# EAGLE design oscillator-v2 (EAGLE 8.7.1)
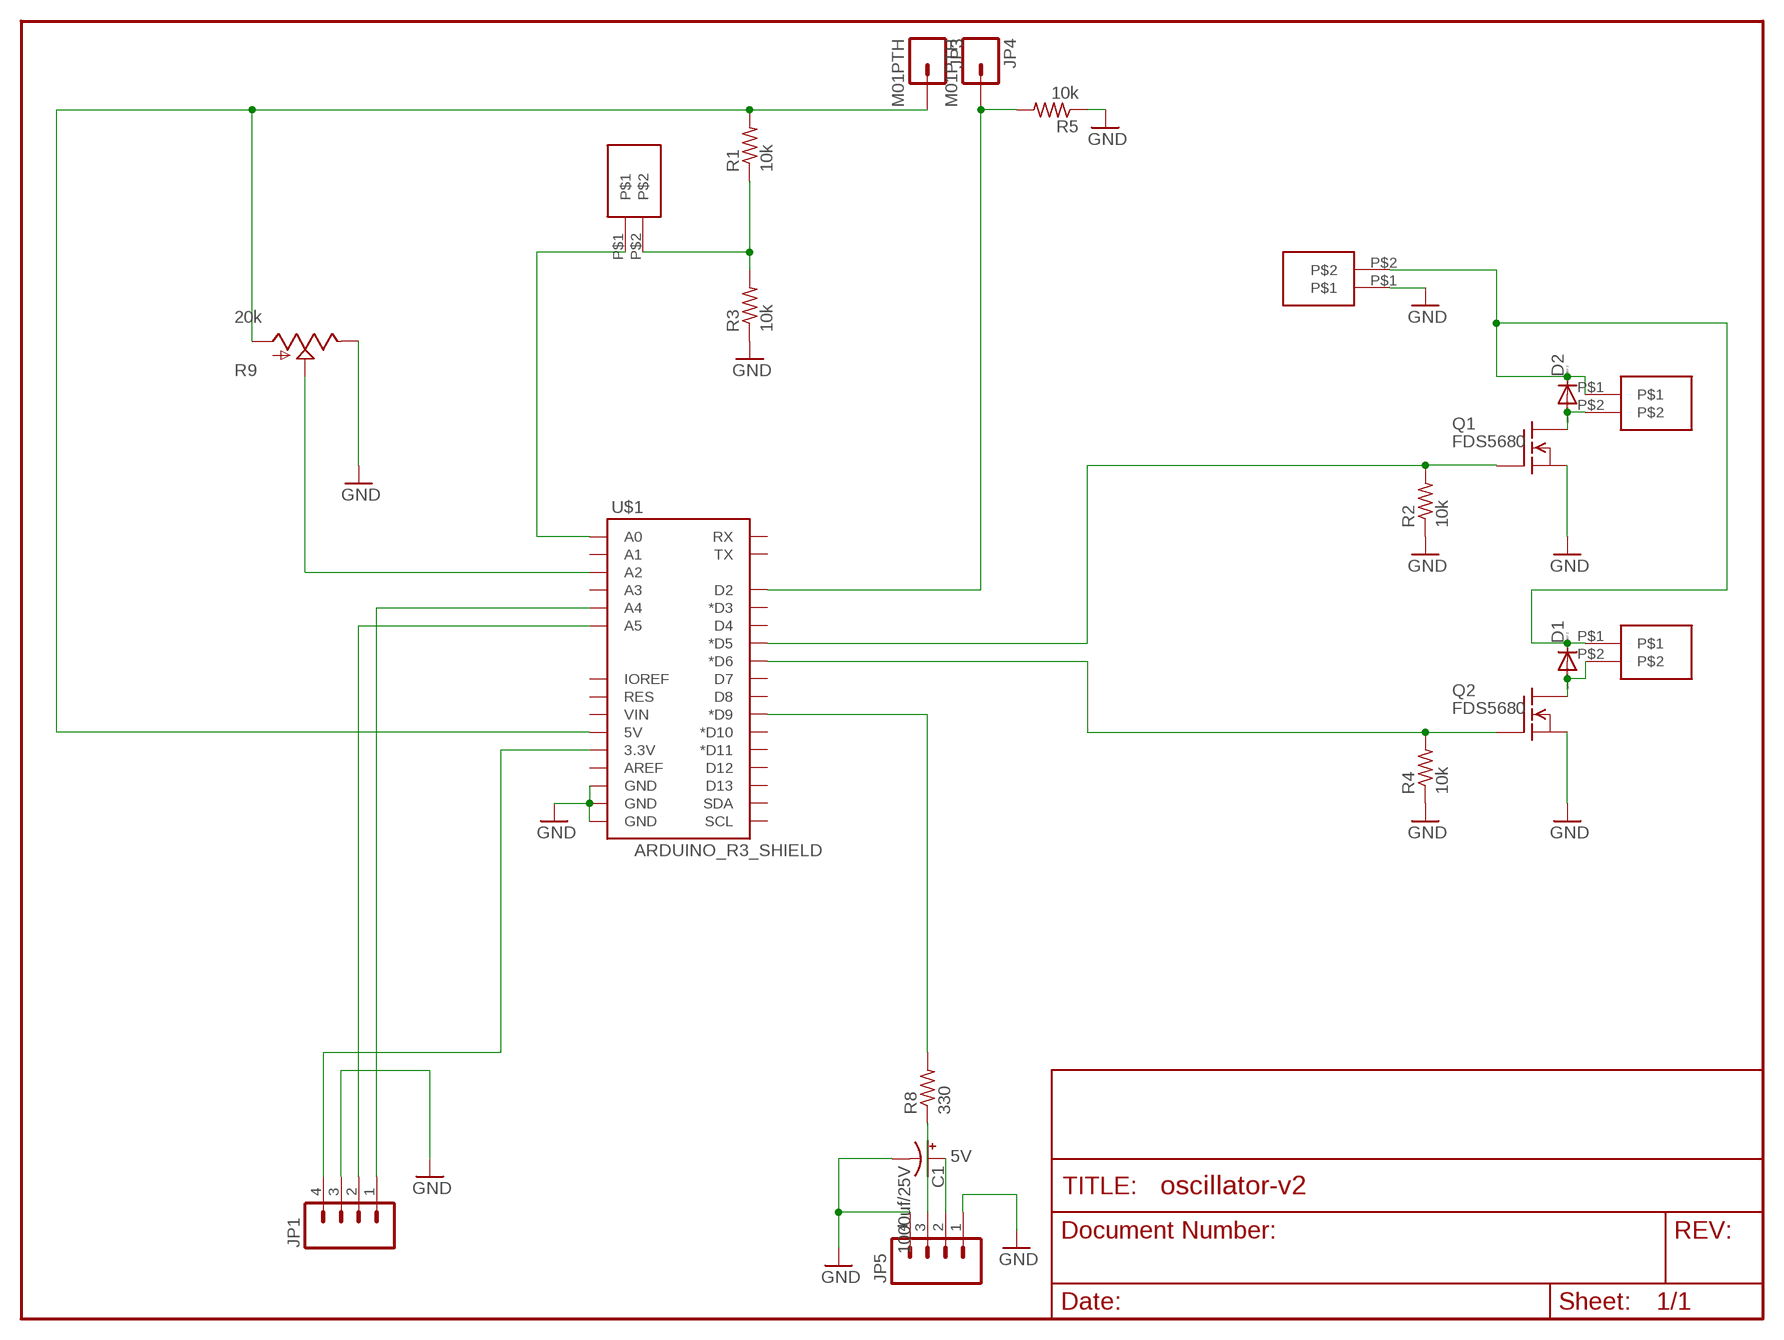
[diagram p0: schematic, sheet 1]

## Parts
C1  1000uf/25V  1000UF-25V(PTH)KIT  [CPOL-RADIAL-1000UF-25V-KIT]
D1  DIODE-DO-214AC  [DO-214AC]
D2  DIODE-DO-214AC  [DO-214AC]
JP1  M04PTH  [1X04]
JP3  M01PTH  [1X01]
JP4  M01PTH  [1X01]
JP5  M04PTH  [1X04]
Q1  FDS5680  [SO-8]
Q2  FDS5680  [SO-8]
R1  10k  R-US_R0603  [R0603]
R2  10k  R-US_R0603  [R0603]
R3  10k  R-US_R0603  [R0603]
R4  10k  R-US_R0603  [R0603]
R5  10k  R-US_R0603  [R0603]
R8  330  R-US_R0603  [R0603]
R9  20k  POTALPS-KIT  [ALPS_POT_KIT]
U$1  ARDUINO_R3_SHIELD  [UNO_R3_SHIELD]
U$6  SPRING-TERMINAL  [SPRING-TERMINAL]
X1  SPRING-TERMINAL  [SPRING-TERMINAL]
X2  SPRING-TERMINAL  [SPRING-TERMINAL]
X5  SPRING-TERMINAL  [SPRING-TERMINAL]

## Nets
5V: C1.+ JP3.1 JP5.2 R1.2 R9.P$3(A) U$1.5V
BUTTON: JP4.1 R5.2 U$1.D2
CL: JP1.2 U$1.A5
DA: JP1.1 U$1.A4
GND: C1.- JP1.3 JP5.1 JP5.4 Q1.1(S) Q1.2(S) Q1.3(S) Q2.1(S) Q2.2(S) Q2.3(S) R2.1 R3.1 R4.1 R5.1 R9.P$1(E) U$1.GND@0(GND) U$1.GND@1(GND) U$1.GND@2(GND) X1.P$1
N$1: Q1.4(G) R2.2 U$1.D5(*D5)
N$4: R8.2 U$1.D9(*D9)
N$5: R1.1 R3.2 X2.P$2
N$8: D2.A Q1.5(D) Q1.6(D) Q1.7(D) Q1.8(D) U$6.P$2
N$12: D1.A Q2.5(D) Q2.6(D) Q2.7(D) Q2.8(D) X5.P$2
N$14: Q2.4(G) R4.2 U$1.D6(*D6)
N$23: U$1.A0 X2.P$1
N$25: JP5.3 R8.1
N$28: R9.P$2(S) U$1.A2
VCC: JP1.4 U$1.3.3V
VIN: D1.C D2.C U$6.P$1 X1.P$2 X5.P$1
Unconnected: U$1.A1 U$1.A3 U$1.AREF U$1.D3(*D3) U$1.D4 U$1.D7 U$1.D8 U$1.D10(*D10) U$1.D11(*D11) U$1.D12 U$1.D13 U$1.IOREF U$1.RES U$1.RX U$1.SCL U$1.SDA U$1.TX U$1.VIN

## Library data of the parts
C1 = SparkFun-Capacitors:1000UF-25V(PTH): CAP-08070; PROD_ID: CAP-09538
D1 D2 = diode:DIODE-: DIODE
JP1 JP5 = SparkFun-Connectors:M04: Header 4 Standard 4-pin 0.1" header. Use with straight break away headers (SKU : PRT-00116), right angle break away headers (PRT-00553), swiss pins (PRT-00743), machine pins (PRT-00117), and female headers (PRT-00115). Molex polarized connector foot print use with SKU : PRT-08231 with associated crimp pins and housings. 1MM SMD Version SKU: PRT-10208
JP3 JP4 = SparkFun-Connectors:M01: Header 1 Standard 1-pin 0.1" header. Use with straight break away headers (SKU : PRT-00116), right angle break away headers (PRT-00553), swiss pins (PRT-00743), machine pins (PRT-00117), and female headers (PRT-00115).
Q1 Q2 = transistor-fet:FDS5680: 60V N-Channel PowerTrench TM MOSFET FAIRCHILD FDS5680.pdf
R1-R5 R8 = resistor:R-US_: RESISTOR, American symbol
R9 = SparkFun-Electromechanical:POT
U$1 = SparkFun-Boards:ARDUINO_R3_SHIELD: Shield form compatible with the Arduino Uno R3.
U$6 X1 X2 X5 = spietz-library:SPRING-TERMINAL

## Net classes
0 default: width 0.203 mm
1 vcc: width 0.254 mm

## Board
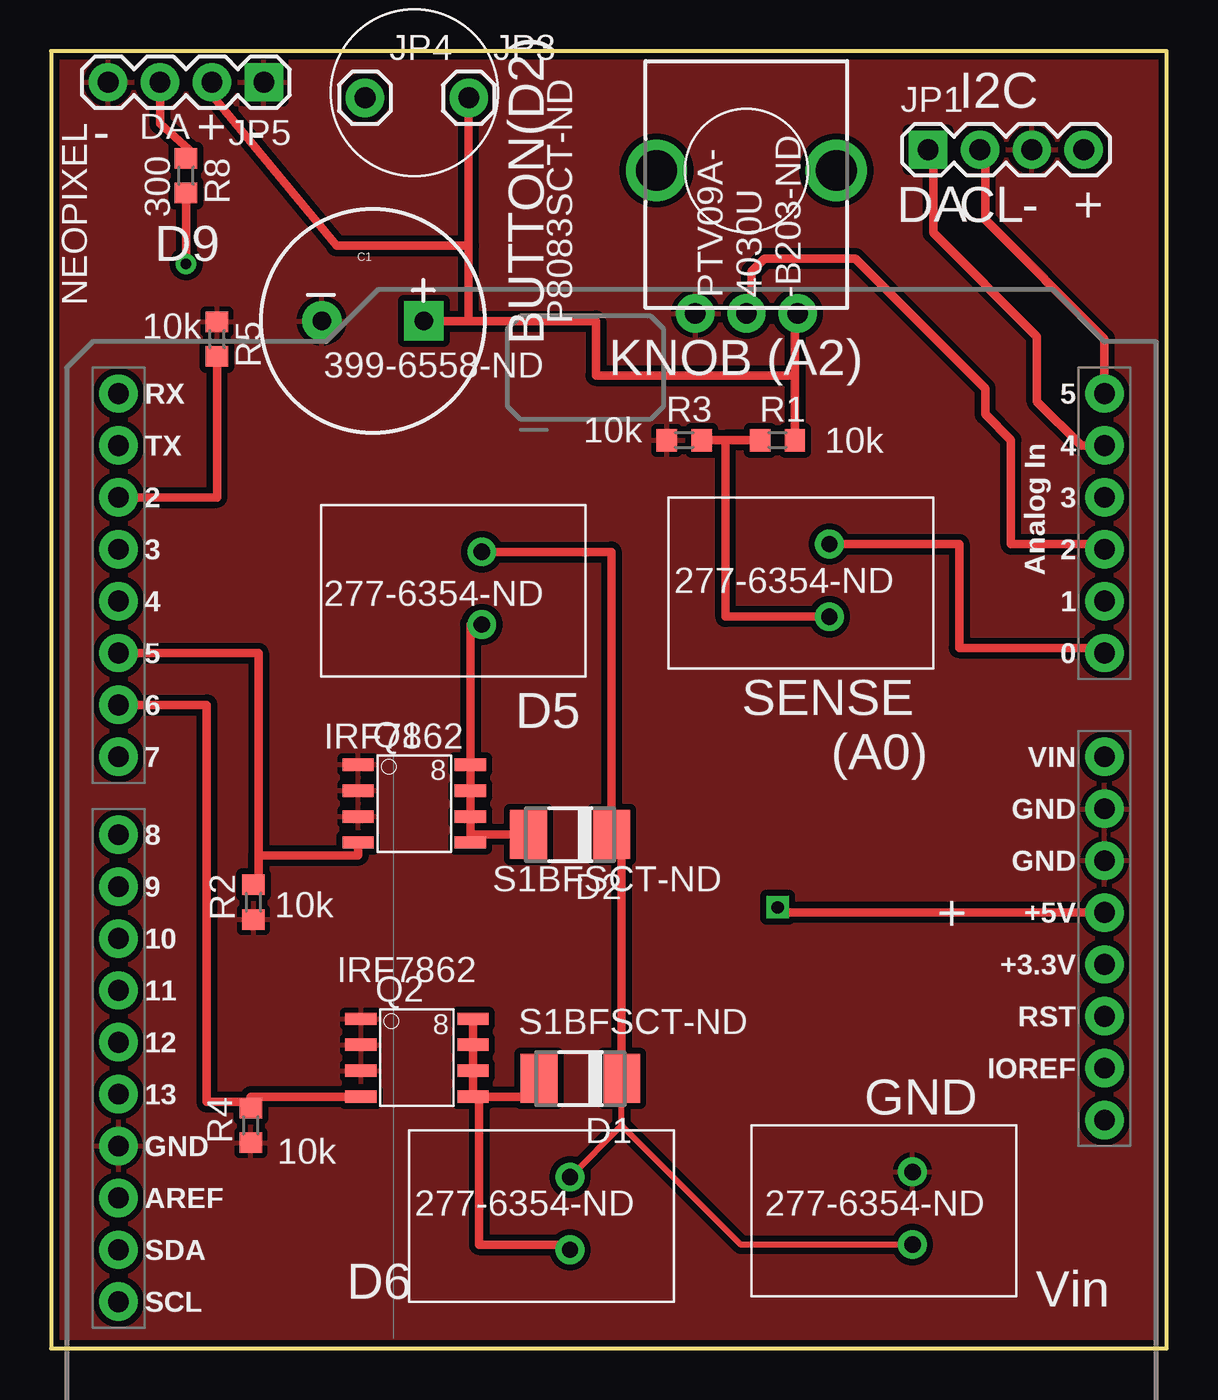
[diagram p1: board, top side]
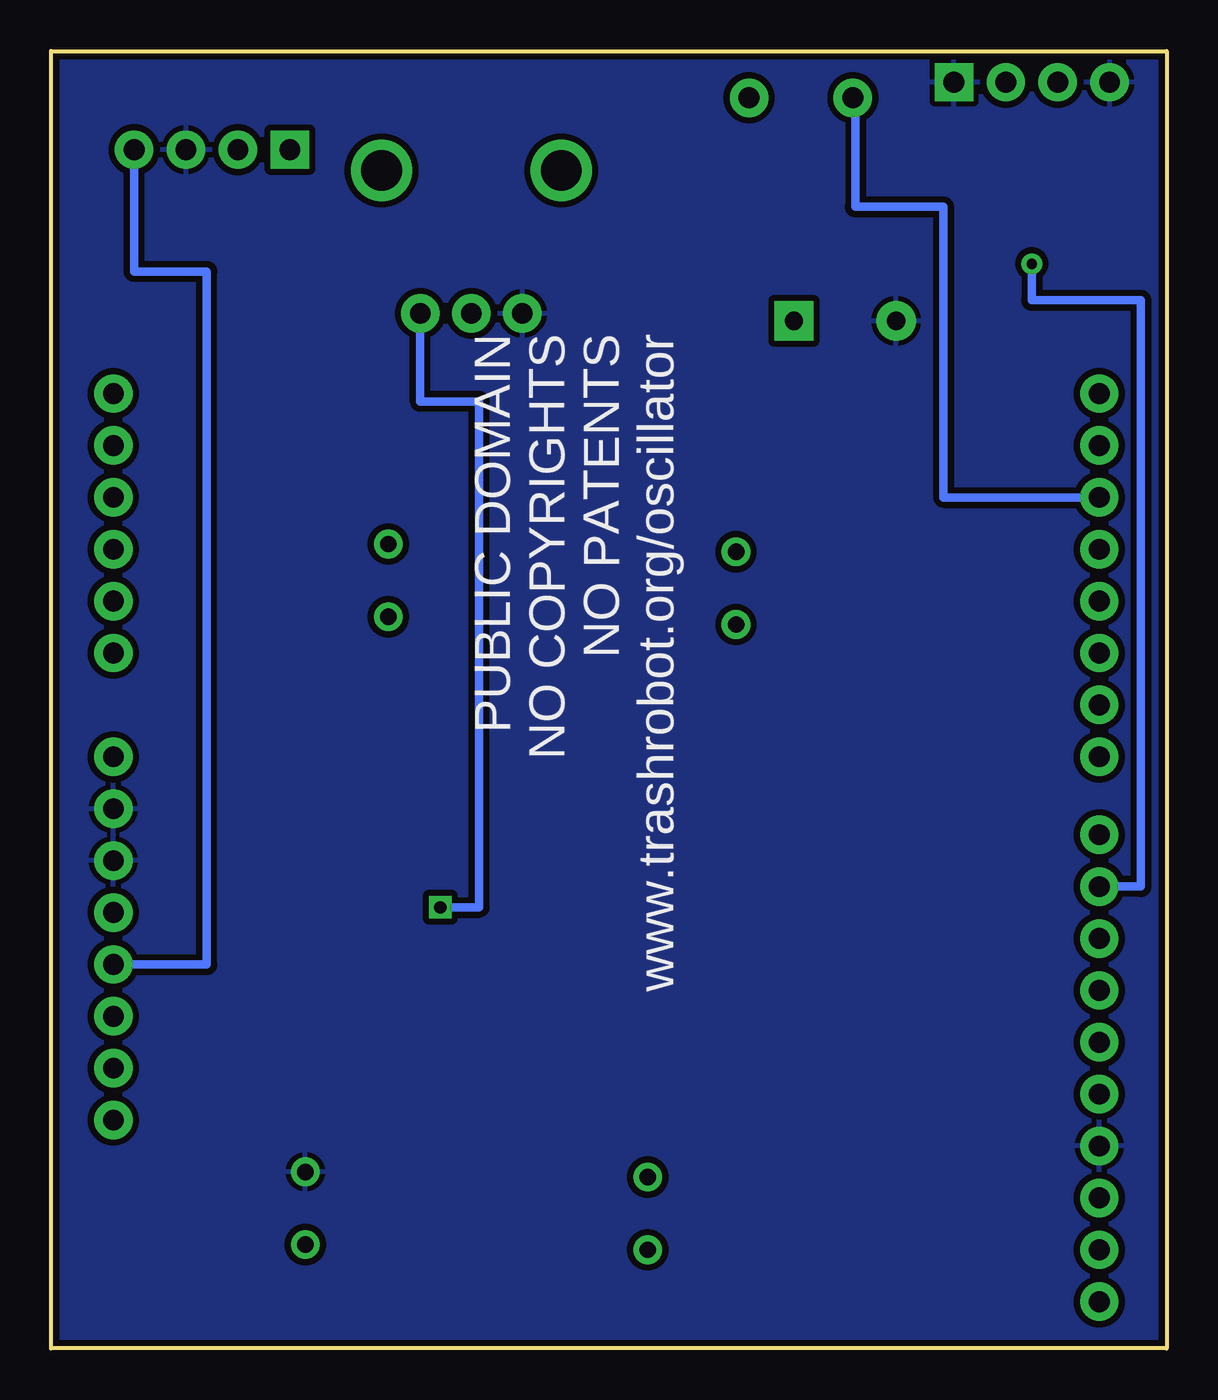
[diagram p2: board, bottom side, seen from below]

Size 54.61 x 63.5 mm. Coordinates in mm from the lower left corner, seen from the top.
Outline: 0,63.5 0,0 54.61,0 54.61,63.5 0,63.5
Copper layers (1*16): Top 0.035mm / dielectric 1.5mm / Bottom 0.035mm
Design rules "default": minimum track width 8mil, minimum drill 20mil, track to track 8mil, track to pad 8mil, pad to pad 8mil, via to via 8mil, smd to smd 8mil, copper to edge 10mil, drill to drill 8mil, minimum pad ring 12mil, minimum via ring 10mil, stop-mask expansion 4mil, vias tented up to drill 25mil, thermal gap 10mil

### Footprints (pad centres in the part's own frame; a part is rotated, then mirrored left to right if it is on the bottom)
CPOL-RADIAL-1000UF-25V-KIT = drill 0.9 pad 1.93 square: + 2.5,0 | drill 0.9 pad 1.93: - -2.5,0
DO-214AC = smd 1.8 x 2.4: A 2.025,0; C -2.025,0
1X04 = drill 1.016 pad 1.88 square: 1 0,0 | drill 1.016 pad 1.88: 2 2.54,0; 3 5.08,0; 4 7.62,0
1X01 = drill 1.016 pad 1.88: 1 0,0
SO-8 = smd 1.524 x 0.61: 1 -2.743,1.905; 2 -2.743,0.635; 3 -2.743,-0.635; 4 -2.743,-1.905; 5 2.743,-1.905; 6 2.743,-0.635; 7 2.743,0.635; 8 2.743,1.905
R0603 = smd 1 x 1.1: 1 -0.85,0; 2 0.85,0
ALPS_POT_KIT = drill 1 pad 1.88: P$1 7,-2.5; P$2 7,0; P$3 7,2.5 | drill 2: P$4 0,-4.4; P$5 0,4.4
UNO_R3_SHIELD = drill 1.016 pad 1.88: 3.3V 50.8,26.67; 5V 50.8,29.21; A0 50.8,41.91; A1 50.8,44.45; A2 50.8,46.99; A3 50.8,49.53; A4 50.8,52.07; A5 50.8,54.61; AREF 2.54,15.24; D2 2.54,49.53; D3 2.54,46.99; D4 2.54,44.45; D5 2.54,41.91; D6 2.54,39.37; D7 2.54,36.83; D8 2.54,33.02; D9 2.54,30.48; D10 2.54,27.94; D11 2.54,25.4; D12 2.54,22.86; D13 2.54,20.32; GND@0 50.8,31.75; GND@1 50.8,34.29; GND@2 2.54,17.78; IOREF 50.8,21.59; NC 50.8,19.05; RES 50.8,24.13; RX 2.54,54.61; SCL 2.54,10.16; SDA 2.54,12.7; TX 2.54,52.07; VIN 50.8,36.83
SPRING-TERMINAL = drill 0.8: P$1 5.08,1.778; P$2 5.08,5.334

### Placement (x,y rotation side)
C1  15.75,50.29 0 top
D1  25.91,13.21 180 top
D2  25.4,25.15 180 top
JP1  42.93,58.67 0 top
JP3  20.45,61.21 0 top
JP4  15.37,61.21 0 top
JP5  10.41,61.98 180 top
Q1  17.78,26.67 0 top
Q2  17.91,14.22 0 top
R1  35.56,44.45 0 top
R2  9.91,21.84 90 top
R3  30.99,44.45 0 top
R4  9.78,10.92 90 top
R5  8.13,49.4 270 top
R8  6.6,57.4 270 top
R9  34.04,57.66 270 top
U$1  0.76,-7.87 0 top
U$6  26.16,40.77 180 top
X1  47.24,10.41 180 top
X2  43.18,41.15 180 top
X5  30.48,10.16 180 top

### Tracks (layer width: path | path; a pad name or v marks a point on that pad's centre or on a via)
5V  (via drill 0.6)
  Top 0.406: R9.P$3 36.41,50.66 36.41,47.62 | 36.41,47.62 R1.2 | 20.45,53.98 20.45,50.29 C1.+ 26.67,50.29 26.67,47.62 36.41,47.62 | 20.45,53.98 JP3.1 | U$1.5V 35.56,21.34 v35.56,21.59 | JP5.2 7.87,61.34 13.97,53.98 20.45,53.98
  Bottom 0.406: v35.56,21.59 33.66,21.59 33.66,46.35 36.54,46.35 R9.P$3
BUTTON
  Top 0.406: U$1.D2 8.13,41.66 R5.2
  Bottom 0.406: JP4.1 15.24,60.2 15.24,55.88 10.92,55.88 10.92,41.66 U$1.D2
CL
  Top 0.406: U$1.A5 51.56,49.4 45.72,55.24 45.72,58.42 JP1.2
DA
  Top 0.406: U$1.A4 50.42,44.2 48.26,46.35 48.26,49.53 43.18,54.61 43.18,58.42 JP1.1
GND
  pour Top (isolate 0.305): 0,63.5 54.61,63.5 54.61,0 0,0
  pour Bottom (isolate 0.305): 0,63.5 54.61,63.5 54.61,0 0,0
N$1
  Top 0.406: U$1.D5 10.16,34.04 10.16,24.13 | 10.16,24.13 15.04,24.13 Q1.4 | R2.2 10.16,22.69 10.16,24.13
N$4  (via drill 0.5)
  Top 0.406: R8.2 v6.6,53.09
  Bottom 0.406: v6.6,53.09 6.6,51.31 1.27,51.31 1.27,22.61 U$1.D9
N$5
  Top 0.406: X2.P$2 33.02,35.81 33.02,44.45 | R1.1 33.02,44.45 | R3.2 33.02,44.45
N$8
  Top 0.406: Q1.5 Q1.6 | Q1.6 Q1.7 20.52,27.94 Q1.8 20.52,35.43 U$6.P$2 | D2.A 20.52,25.15 Q1.6
N$12
  Top 0.406: Q2.8 Q2.7 Q2.6 Q2.5 | Q2.5 23.88,12.32 D1.A | Q2.5 20.95,12.32 20.95,5.08 25.4,5.08 X5.P$2
N$14
  Top 0.406: Q2.4 9.78,12.32 R4.2 9.78,12.06 7.62,12.06 7.62,31.5 U$1.D6
N$23
  Top 0.406: X2.P$1 44.45,39.37 44.45,34.29 51.56,34.29 U$1.A0
N$25
  Top 0.254: R8.1 6.76,58.67
  Top 0.406: 6.76,58.67 5.33,59.94 JP5.3
N$28
  Top 0.406: R9.P$2 34.29,50.66 34.29,52.7 34.93,53.34 39.37,53.34 45.72,46.99 45.72,45.72 46.99,44.45 46.99,39.37 51.56,39.37 U$1.A2
VCC
  Bottom 0.406: U$1.3.3V 46.99,18.8 46.99,52.7 50.55,52.7 JP1.4
VIN
  Top 0.305: X5.P$1 27.93,10.91 | 27.93,10.91 D1.C | X1.P$2 33.77,5.08 27.93,10.91
  Top 0.406: D1.C 27.93,25.15 D2.C 27.43,38.99 U$6.P$1

### Text on the board
tPlace: I2C | - | DA | + | - | 300 | D9 | DA | CL | - | + | NEOPIXEL | PTV09A- / 4030U / -B203-ND | P8083SCT-ND | 10k | 399-6558-ND | BUTTON(D2) | KNOB (A2) | 10k | 10k | 277-6354-ND | 277-6354-ND | SENSE / (A0) | D5 | IRF7862 | S1BFSCT-ND | + | 10k | IRF7862 | S1BFSCT-ND | GND | 10k | 277-6354-ND | 277-6354-ND | Vin | D6
bPlace: PUBLIC DOMAIN / NO COPYRIGHTS / NO PATENTS / www.trashrobot.org/oscillator
tValues: Tent Vias! | Arduino Wee v1.3